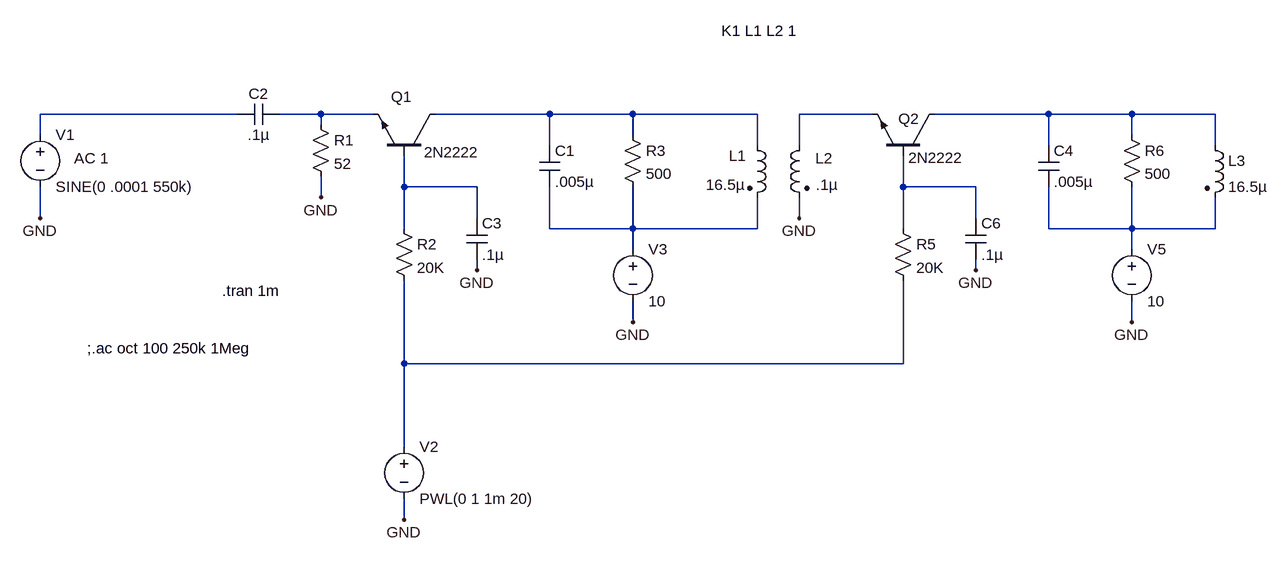
[diagram p0: schematic Draft53.asc]
Draft53.asc, the LTspice schematic file:
Version 4
SHEET 1 3344 1860
WIRE 2048 1216 2224 1216
WIRE 2544 1216 2544 1264
WIRE 2224 1216 2224 1264
WIRE 2224 1216 2352 1216
WIRE 2224 1392 2352 1392
WIRE 2544 1344 2544 1392
WIRE 2224 1328 2224 1392
WIRE 1952 1216 1872 1216
WIRE 1872 1216 1872 1232
WIRE 1872 1312 1872 1344
WIRE 1872 1216 1808 1216
WIRE 1744 1216 1440 1216
WIRE 1440 1216 1440 1248
WIRE 1440 1328 1440 1376
WIRE 2000 1280 2000 1328
WIRE 2000 1472 2000 1600
WIRE 2000 1808 2000 1840
WIRE 2000 1328 2000 1392
WIRE 2000 1328 2112 1328
WIRE 2112 1328 2112 1376
WIRE 2112 1440 2112 1456
WIRE 2352 1392 2352 1424
WIRE 2352 1504 2352 1536
WIRE 2352 1392 2544 1392
WIRE 2352 1392 2352 1328
WIRE 2352 1248 2352 1216
WIRE 2352 1216 2544 1216
WIRE 2816 1216 2992 1216
WIRE 3248 1216 3248 1264
WIRE 2992 1216 2992 1264
WIRE 2992 1216 3120 1216
WIRE 2992 1392 3120 1392
WIRE 3248 1344 3248 1392
WIRE 2992 1328 2992 1392
WIRE 2720 1216 2608 1216
WIRE 2768 1280 2768 1328
WIRE 2768 1472 2768 1600
WIRE 2768 1328 2768 1392
WIRE 2768 1328 2880 1328
WIRE 2880 1328 2880 1376
WIRE 2880 1440 2880 1456
WIRE 3120 1392 3120 1424
WIRE 3120 1504 3120 1536
WIRE 3120 1392 3248 1392
WIRE 3120 1392 3120 1328
WIRE 3120 1248 3120 1216
WIRE 3120 1216 3248 1216
WIRE 2608 1216 2608 1264
WIRE 2608 1344 2608 1376
WIRE 2000 1600 2768 1600
WIRE 2000 1600 2000 1728
FLAG 1872 1344 GND
FLAG 1440 1376 GND
FLAG 2000 1840 GND
FLAG 2112 1456 GND
FLAG 2352 1536 GND
FLAG 2880 1456 GND
FLAG 3120 1536 GND
FLAG 2608 1376 GND
SYMBOL npn 2048 1280 M270
WINDOW 0 91 68 VLeft 0
WINDOW 3 5 17 VLeft 0
SYMATTR InstName Q1
SYMATTR Value 2N2222
SYMBOL ind2 2528 1248 R0
WINDOW 0 -1 32 Right 0
WINDOW 3 -3 77 Right 0
SYMATTR InstName L1
SYMATTR Value 16.5µ
SYMBOL cap 2208 1264 R0
SYMATTR InstName C1
SYMATTR Value .005µ
SYMBOL res 1856 1216 R0
SYMATTR InstName R1
SYMATTR Value 52
SYMBOL cap 1808 1200 R90
WINDOW 0 0 32 VBottom 0
WINDOW 3 32 32 VTop 0
SYMATTR InstName C2
SYMATTR Value .1µ
SYMBOL voltage 1440 1232 R0
WINDOW 39 0 0 Left 0
WINDOW 123 52 52 Left 0
SYMATTR InstName V1
SYMATTR Value SINE(0 .0001 550k)
SYMATTR Value2 AC 1
SYMBOL res 1984 1376 R0
SYMATTR InstName R2
SYMATTR Value 20K
SYMBOL voltage 2000 1712 R0
SYMATTR InstName V2
SYMATTR Value PWL(0 1 1m 20)
SYMBOL cap 2096 1376 R0
SYMATTR InstName C3
SYMATTR Value .1µ
SYMBOL voltage 2352 1408 R0
SYMATTR InstName V3
SYMATTR Value 10
SYMBOL res 2336 1232 R0
SYMATTR InstName R3
SYMATTR Value 500
SYMBOL npn 2816 1280 M270
WINDOW 0 57 55 VLeft 0
WINDOW 3 -3 40 VLeft 0
SYMATTR InstName Q2
SYMATTR Value 2N2222
SYMBOL ind2 3232 1248 R0
SYMATTR InstName L3
SYMATTR Value 16.5µ
SYMBOL cap 2976 1264 R0
SYMATTR InstName C4
SYMATTR Value .005µ
SYMBOL res 2752 1376 R0
SYMATTR InstName R5
SYMATTR Value 20K
SYMBOL cap 2864 1376 R0
SYMATTR InstName C6
SYMATTR Value .1µ
SYMBOL voltage 3120 1408 R0
SYMATTR InstName V5
SYMATTR Value 10
SYMBOL res 3104 1232 R0
SYMATTR InstName R6
SYMATTR Value 500
SYMBOL ind2 2624 1248 M0
WINDOW 0 -9 36 Right 0
WINDOW 3 -10 77 Right 0
SYMATTR InstName L2
SYMATTR Value .1µ
text 1720 1488 Left 0 !.tran 1m
text 1512 1576 Left 0 !;.ac oct 100 250k 1Meg
text 2488 1088 Left 0 !K1 L1 L2 1

The netlist it stands for:
* Draft53.asc
Q1 N001 N005 N003 0 2N2222
L1 N001 N002 16.5µ
C1 N001 N002 .005µ
R1 N003 GND 52
C2 N003 N004 .1µ
V1 N004 GND SINE(0 .0001 550k) AC 1
R2 N005 N006 20K
V2 N006 GND PWL(0 1 1m 20)
C3 N005 GND .1µ
V3 N002 GND 10
R3 N001 N002 500
Q2 N007 N010 N009 0 2N2222
L3 N007 N008 16.5µ
C4 N007 N008 .005µ
R5 N010 N006 20K
C6 N010 GND .1µ
V5 N008 GND 10
R6 N007 N008 500
L2 N009 GND .1µ
.model NPN NPN
.model PNP PNP
.lib standard.bjt
.tran 1m
;.ac oct 100 250k 1Meg
K1 L1 L2 1
.backanno
.end